# Altium schematic sheet Sch_front.SchDoc
size A
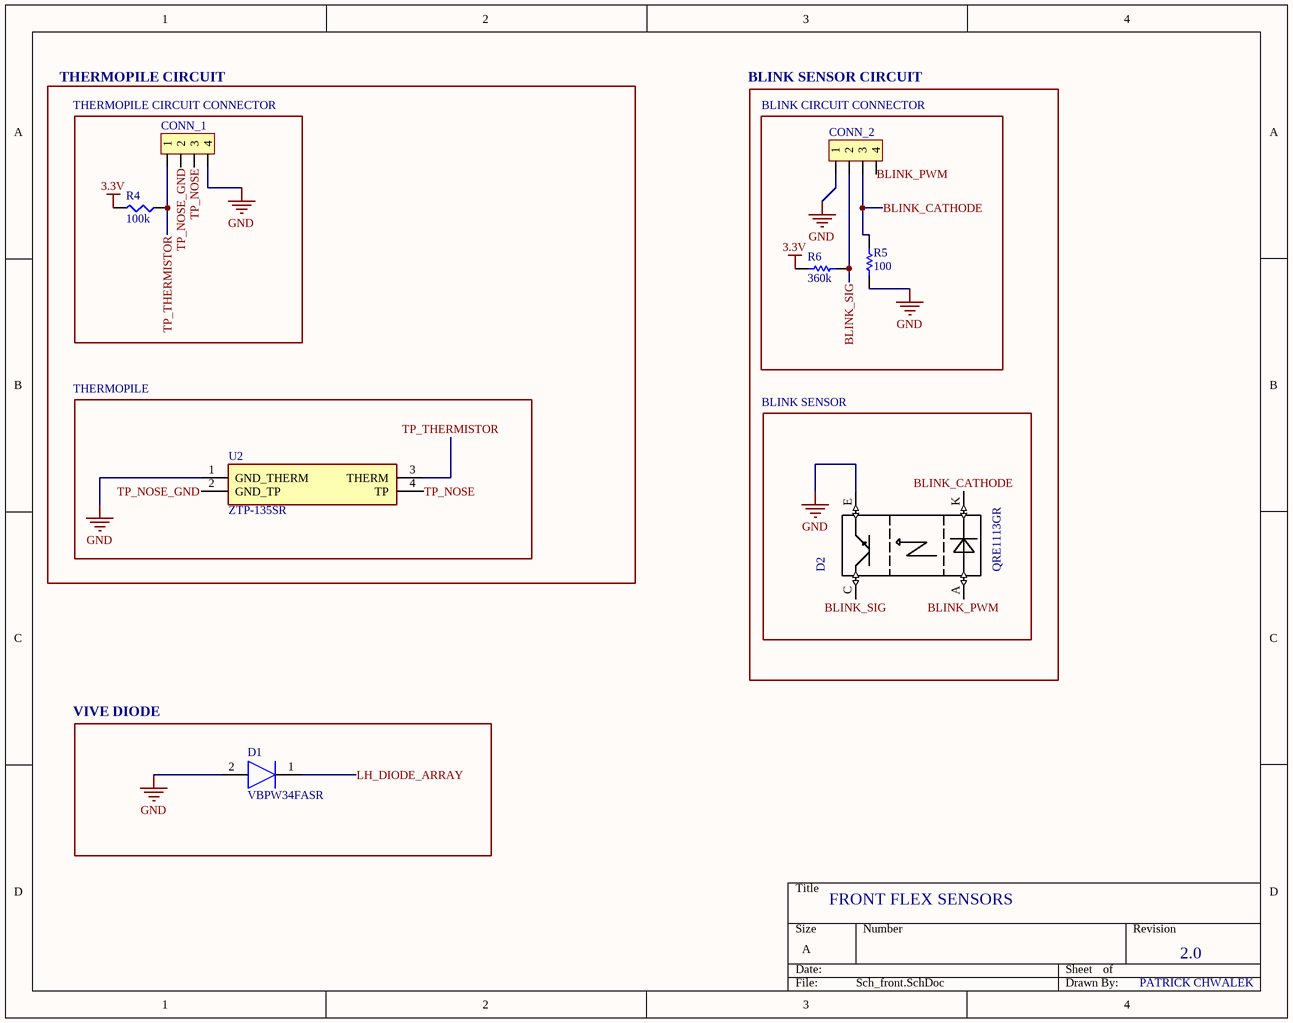
[diagram p0: Sch_front.SchDoc]

## Parts
CONN_1  THERMO  [4_pos_1mm_header]  (value not drawn)
CONN_2  BLINK  [4_pos_1mm_header]  (value not drawn)
D1  VBPW34FASR  [VBPW34FAS]
D2  QRE1113GR  [*4LEADSMD_QRE1113GR(Primary)]
R4  100k  [SMD-0402-RES]
R5  100  [0402R]
R6  360k  [0402R]
U2  ZTP-135SR  [ZTP-135SR]

## Blocks framed on the sheet
THERMOPILE CIRCUIT CONNECTOR: CONN_1 R4
BLINK CIRCUIT CONNECTOR: CONN_2 R5 R6
THERMOPILE: U2
BLINK SENSOR: D2
VIVE DIODE: D1

## Nets
3.3V: R4.2 R6.2
GND: CONN_1.4 CONN_2.1 D1.2(K) D2.E R5.1 U2.1(GND_THERM)
BLINK_CATHODE: CONN_2.3 D2.K R5.2
BLINK_PWM: CONN_2.4 D2.A
BLINK_SIG: CONN_2.2 D2.C R6.1
LH_DIODE_ARRAY: D1.1(A)
TP_NOSE: CONN_1.3 U2.4(TP)
TP_NOSE_GND: CONN_1.2 U2.2(GND_TP)
TP_THERMISTOR: CONN_1.1 R4.1 U2.3(THERM)

## Notes on the sheet
- THERMOPILE CIRCUIT
- BLINK SENSOR CIRCUIT
- FRONT FLEX SENSORS
- 2.0
- PATRICK CHWALEK

## Library data of the parts
CONN_1 CONN_2 = 4_pin_1mm_header
D1 = VBPW34FASR: Diode; Manufacturer_Name: Vishay; Datasheet Link: https://www.vishay.com/docs/81127/vbpw34fa.pdf; Height: 1.3mm; Manufacturer_Part_Number: VBPW34FASR; Mouser Part Number: 782-VBPW34FASR; Mouser Price/Stock: https://www.mouser.com/Search/Refine.aspx?Keyword=782-VBPW34FASR; RS Part Number: 7689401; RS Price/Stock: https://uk.rs-online.com/web/p/products/7689401
D2 = QRE1113GR: QRE1113 Series 30 V 50 mA Miniature Reflective Object Sensor - SMD-4; MF: ON Semiconductor; Price: None; MP: QRE1113GR; SnapEDA_Link: https://www.snapeda.com/parts/QRE1113GR/ON%20Semiconductor/view-part/?ref=snap; Package: SMD-4 ON Semiconductor; Availability: Unavailable; Value: *
R4 = ERJ-2GEJ104X: RES SMD 100K OHM 5% 1/10W 0402; Manufacturer: Panasonic Electronic Components; Factory Stock: 0; Unit Price (USD): 0.00350; @ qty: 1500; Minimum Quantity: 1; Power (Watts): 0.1W, 1/10W; Temperature Coefficient: ±200ppm/°C; Part Number: ERJ-2GEJ104X; Datasheets: http://industrial.panasonic.com/www-cgi/jvcr13pz.cgi?E+PZ+3+AOA0001+ERJ2GEJ104X+7+WW; Image: //media.digikey.com/Photos/Panasonic%20Photos/ERJ-PA2-Series.jpg; Digi-Key Part Number: P100KJCT-ND; Quantity Available: 2387986; Packaging: Cut Tape (CT); Series: ERJ; Part Status: Active; Value: 100k; Tolerance: ±5%; Composition: Thick Film; Features: Automotive AEC-Q200; Operating Temperature: -55°C ~ 155°C; Package / Case: 0402 (1005 Metric); Supplier Device Package: 0402; Size / Dimension: 0.039" L x 0.020" W (1.00mm x 0.50mm); Height - Seated (Max): 0.016" (0.40mm); Number of Terminations: 2; Failure Rate: -
R5 = Resistor
R6 = Resistor: RC0402FR-07360KL
U2 = ZTP-135SR: Undefined or Miscellaneous; Manufacturer_Name: Amphenol Advanced Sensors; Allied_Number: 70282698; Datasheet Link: https://www.amphenol-sensors.com/en/component/edocman/370-thermopile-ir-sensor-applications/download?Itemid=7967; Manufacturer_Part_Number: ZTP-135SR; Mouser Part Number: 527-ZTP-135SR; Mouser Price/Stock: https://www.mouser.com/Search/Refine.aspx?Keyword=527-ZTP-135SR; Allied Price/Stock: https://www.alliedelec.com/amphenol-advanced-sensors-ztp-135sr/70282698/